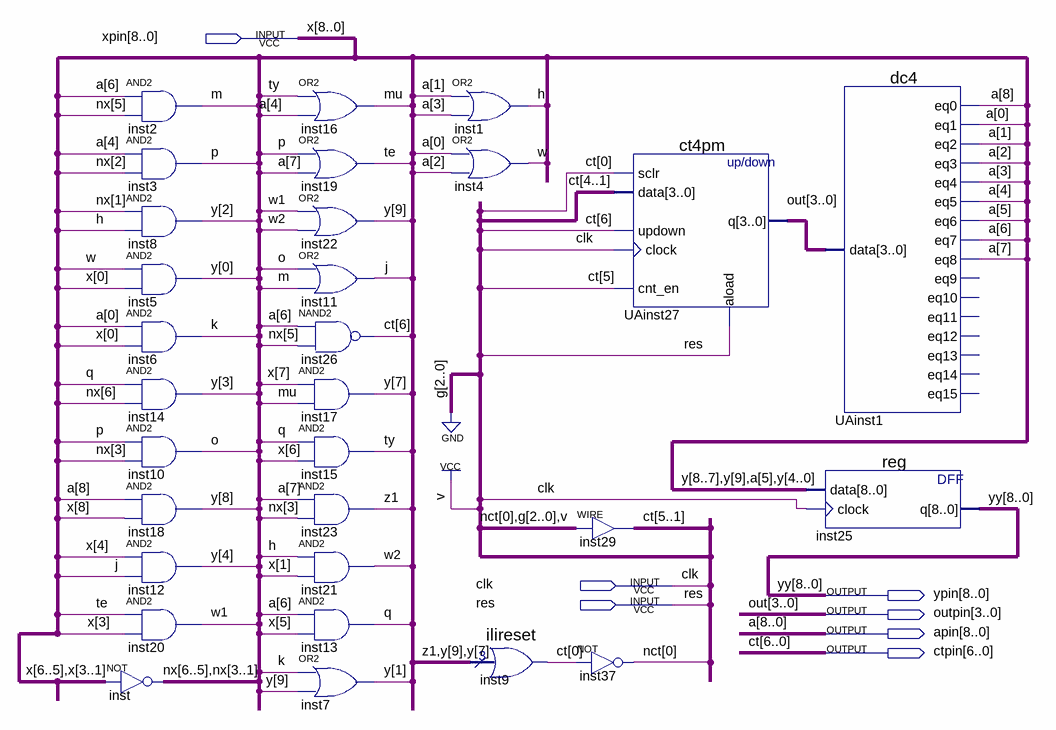
[diagram p0: schematic sheet]
// Quartus schematic test2.bdf as structural Verilog: 30 symbols, 7 pins
module test2 (
  input  [8:0] xpin,
  input  clk,
  input  res,
  output [8:0] ypin,
  output [3:0] outpin,
  output [8:0] apin,
  output [6:0] ctpin
);

  wire h, j, k, m, mu, o, p, q, te, ty, w, w1, w2, z1;
  wire [0:0] nct;
  wire [6:1] nx;
  wire [9:0] y;

  and inst2 (m, apin[6], nx[5]);
  and inst3 (p, apin[4], nx[2]);
  and inst8 (y[2], nx[1], h);
  and inst5 (y[0], w, xpin[0]);
  and inst6 (k, apin[0], xpin[0]);
  and inst14 (y[3], q, nx[6]);
  and inst10 (o, p, nx[3]);
  and inst18 (y[8], apin[8], xpin[8]);
  and inst12 (y[4], xpin[4], j);
  and inst20 (w1, te, xpin[3]);
  assign {nx[6:5], nx[3:1]} = ~{xpin[6:5], xpin[3:1]};  // NOT inst, 5 bits wide
  or inst16 (mu, ty, apin[4]);
  or inst19 (te, p, apin[7]);
  or inst22 (y[9], w1, w2);
  or inst11 (j, o, m);
  nand inst26 (ctpin[6], apin[6], nx[5]);
  and inst17 (y[7], xpin[7], mu);
  and inst15 (ty, q, xpin[6]);
  and inst23 (z1, apin[7], nx[3]);
  and inst21 (w2, h, xpin[1]);
  and inst13 (q, apin[6], xpin[5]);
  or inst7 (y[1], k, y[9]);
  or inst1 (h, apin[1], apin[3]);
  or inst4 (w, apin[0], apin[2]);
  ilireset inst9 (.data({z1, y[9], y[7]}), .result(ctpin[0]));
  assign ctpin[5:1] = {nct[0], 4'b0001};  // WIRE inst29
  not inst37 (nct[0], ctpin[0]);
  ct4pm UAinst27 (
    .sclr(ctpin[0]), .data(ctpin[4:1]), .updown(ctpin[6]), .clock(clk), .cnt_en(ctpin[5]), .aload(res),
    .q(outpin));
  dc4 UAinst1 (
    .data(outpin), .eq0(apin[8]), .eq1(apin[0]), .eq2(apin[1]), .eq3(apin[2]), .eq4(apin[3]), .eq5(apin[4]),
    .eq6(apin[5]), .eq7(apin[6]), .eq8(apin[7]));  // open: eq9, eq10, eq11, eq12, eq13, eq14, eq15
  \reg  inst25 (.data({y[8:7], y[9], apin[5], y[4:0]}), .clock(clk), .q(ypin));

  // Other names for the same wires on the sheet: a[8:0] = apin; ct[6:0] = ctpin; out[3:0] = outpin; x[8:0] = xpin;
  //   yy[8:0] = ypin
endmodule
